# Altium project caton-pcb.PrjPcb (part 1 of 2)
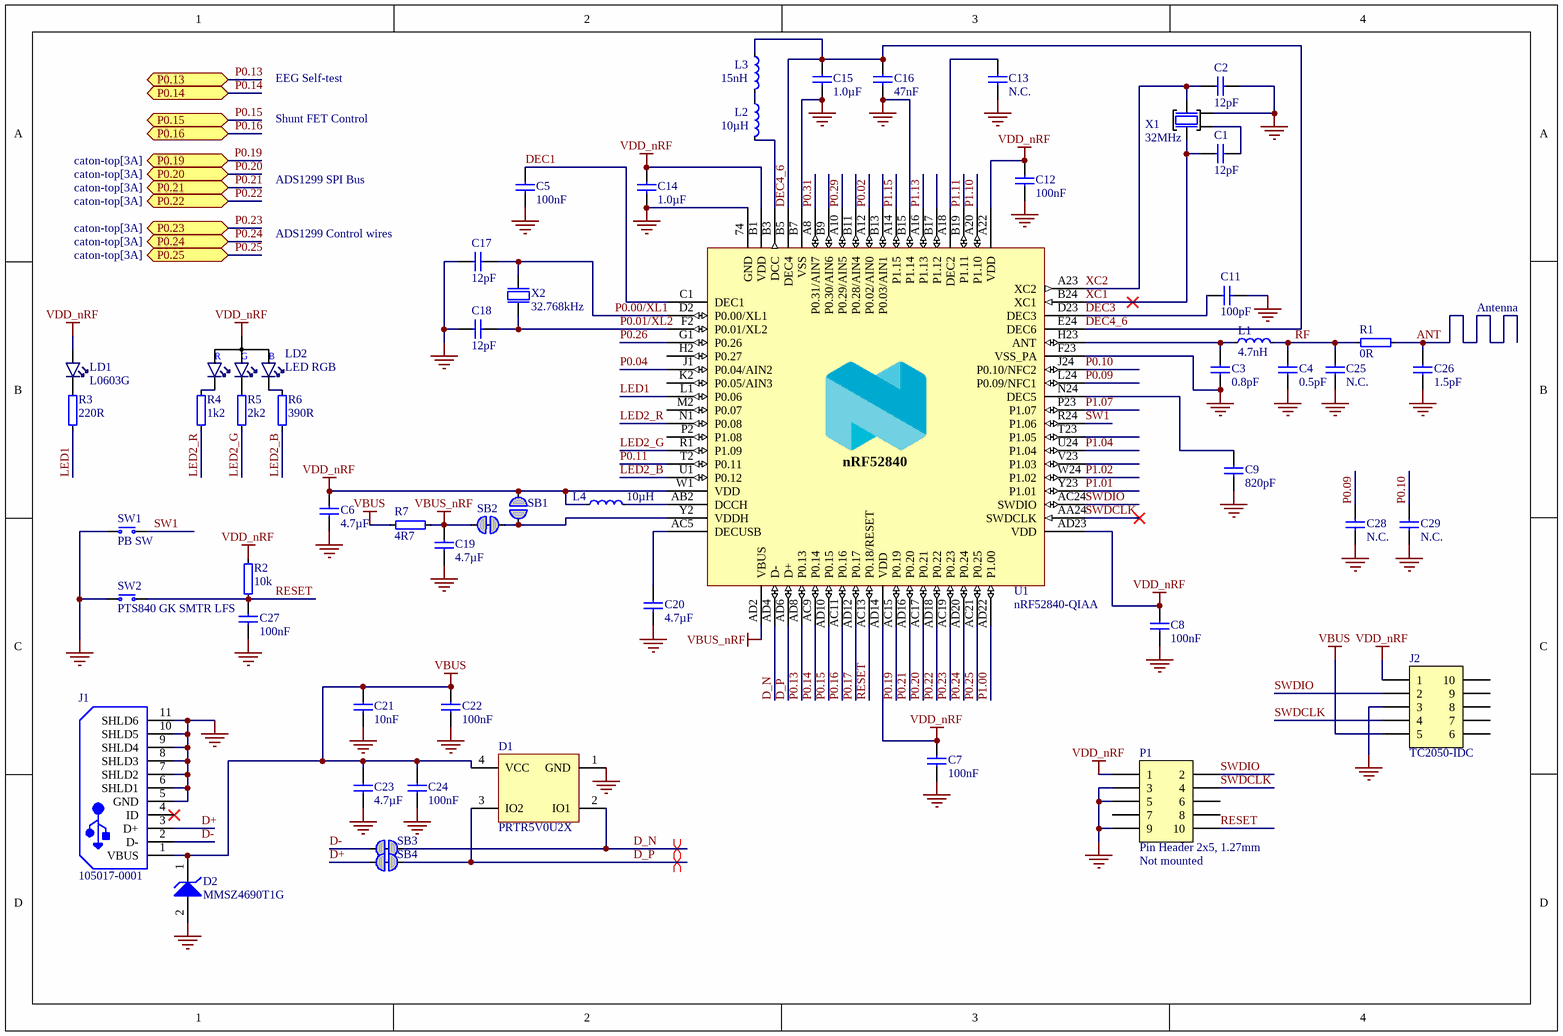
[diagram p0: caton-nrf52840.SchDoc]
3 sheets, 147 parts. Net scope: hierarchical (ports join the sheet entries above them; power ports are global).
Board files: 400250.PcbDoc, caton.PcbDoc
Sheets:
  caton-nrf52840.SchDoc
  caton-top.SchDoc
  caton-ads1299.SchDoc

## Sheet caton-nrf52840.SchDoc: =BoardTitle
size A4; Organization: Nordic Semiconductor; SheetNumber: 2; SheetTotal: 3; CompanyName: Nordic Semiconductor; DocumentSize: A4; ProjectName: caton-pcb.PrjPcb

### Parts
(Parts that share a designator on the sheet are numbered #1, #2 ... from top to bottom, then left to right.)
C1#1  12pF  [CAPC0603X03L_C]
C2#1  12pF  [CAPC0603X03L_C]
C3#1  0.8pF  [CAPC0603X03L_C]
C4#1  0.5pF  [CAPC0603X03L_C]
C5#1  100nF  [CAPC0603X03L_C]
C6#1  4.7µF  [CAPC1608X06L]
C7#1  100nF  [CAPC0603X03L_C]
C8#1  100nF  [CAPC0603X03L_C]
C9#1  820pF  [CAPC0603X03L_C]
C11#1  100pF  [CAPC0603X03L_C]
C12#1  100nF  [CAPC0603X03L_C]
C13#1  N.C.  [CAPC0603X03L_C_NC]
C14#1  1.0µF  [CAPC1608X06L]
C15#1  1.0µF  [CAPC1608X06L]
C16#1  47nF  [CAPC0603X03L_C]
C17#1  12pF  [CAPC0603X03L_C]
C18#1  12pF  [CAPC0603X03L_C]
C19#1  4.7µF  [CAPC1005X04L]
C20#1  4.7µF  [CAPC1608X06L]
C21#1  10nF  [CAPC0603X03L_C]
C22#1  100nF  [CAPC0603X03L_C]
C23#1  4.7µF  [CAPC1005X04L]
C24#1  100nF  [CAPC0603X03L_C]
C25#1  N.C.  [CAPC0603X03L_C_NC]
C26#1  1.5pF  [CAPC0603X03L_C]
C27#1  100nF  [CAPC0603X03L_C]
C28#1  N.C.  [CAPC1005X04L_NC]
C29  N.C.  [CAPC1005X04L_NC]
D1  PRTR5V0U2X  [SOT190P230X110-4L]
D2  MMSZ4690T1G  [ONSC-SOD-123-2-425-04_V]
J1#1  105017-0001  [USB-MICRO-B_V]
J2#1  TC2050-IDC  [TC2050-IDC-NLFP]  (no BOM)
L1  4.7nH  [INDC0603X03L_C]
L2  10µH  [INDC1608X06L]
L3  15nH  [INDC1005X04L]
L4  10µH  [INDC1608X06L]
LD1  L0603G  [LED_0603_G]
LD2  LED RGB  [LED_RGB_0603]
P1  Pin Header 2x5, 1.27mm  Assembly: Not mounted  [HDR_2x5-SMD-1.27mm-NC]
R1#1  0R  [RESC0603X03L_C]
R2#1  10k  [RESC0603X03L_C]
R3#1  220R  [RESC0603X03L_C]
R4#1  1k2  [RESC0603X03L_C]
R5#1  2k2  [RESC0603X03L_C]
R6#1  390R  [RESC0603X03L_C]
R7#1  4R7  [RESC0603X03L_C]
SB1#1  Solderbridge  [Solderbridge]  (value not drawn)  (no BOM)
SB2  Solderbridge  [Solderbridge_Shorted]  (value not drawn)  (net tie, no BOM)
SB3  Solderbridge  [Solderbridge_Shorted]  (value not drawn)  (net tie, no BOM)
SB4  Solderbridge  [Solderbridge_Shorted]  (value not drawn)  (net tie, no BOM)
SW1  PB SW  [C&K_PTS810]
SW2  PTS840 GK SMTR LFS  [EVQP7A_J_B_K]
U1#1  nRF52840-QIAA  [AQFN50P700X700X85_HS-74N]
X1  32MHz  [BT-XTAL_2016]
X2  32.768kHz  [XTAL_2012]

### Ports
P0.13 (bidir), P0.14 (bidir), P0.15 (bidir), P0.16 (bidir), P0.19 (bidir, see caton-top[3A]), P0.20 (bidir, see caton-top[3A]), P0.21 (bidir, see caton-top[3A]), P0.22 (bidir, see caton-top[3A]), P0.23 (bidir, see caton-top[3A]), P0.24 (bidir, see caton-top[3A]), P0.25 (bidir, see caton-top[3A])

### Nets
GND: C2#1.2 C3#1.1 C4#1.1 C5#1.2 C6#1.2 C7#1.2 C8#1.2 C9#1.2 C11#1.2 C12#1.2 C13#1.2 C14#1.2 C15#1.1 C16#1.2 C17#1.2 C18#1.2 C19#1.2 C20#1.2 C21#1.1 C22#1.1 C23#1.1 C24#1.1 C25#1.2 C26#1.1 C27#1.1 C28#1.1 C29.2 D1.1(GND) D2.2(A) J1#1.5(GND) J1#1.6(SHLD1) J1#1.7(SHLD2) J1#1.8(SHLD3) J1#1.9(SHLD4) J1#1.10(SHLD5) J1#1.11(SHLD6) J2#1.3 P1.3 P1.5 P1.9 SW1.2(COM) SW2.2(COM) U1#1.74(GND) U1#1.B7(VSS) U1#1.B15(P1.14) U1#1.F23(VSS_PA) X1.2(GND)
VBUS: C21#1.2 C22#1.2 C23#1.2 C24#1.2 D1.4(VCC) D2.1(K) J1#1.1(VBUS) J2#1.5 R7#1.2
VBUS_nRF: C19#1.1 R7#1.1 SB2.2 U1#1.AD2(VBUS)
VDD_nRF: C6#1.1 C7#1.1 C8#1.1 C12#1.1 C14#1.1 J2#1.1 L4.1 LD1.2(A) LD2.4(A) P1.1 R2#1.2 SB1#1.1 U1#1.A22(VDD) U1#1.AD14(VDD) U1#1.AD23(VDD) U1#1.B1(VDD) U1#1.W1(VDD)
ANT: C26#1.2 R1#1.2
D+: J1#1.3(D+) SB4.2
D-: J1#1.2(D-) SB3.2
D_N: D1.2(IO1) SB3.1 U1#1.AD4(D-)
D_P: D1.3(IO2) SB4.1 U1#1.AD6(D+)
DEC1: C5#1.1 U1#1.C1(DEC1)
DEC3: C11#1.1 U1#1.D23(DEC3)
DEC4_6: C15#1.2 C16#1.1 L3.1 U1#1.B5(DEC4) U1#1.E24(DEC6)
LED1: R3#1.1 U1#1.L1(P0.06)
LED2_B: R6#1.1 U1#1.U1(P0.12)
LED2_G: R5#1.1 U1#1.R1(P1.09)
LED2_R: R4#1.1 U1#1.N1(P0.08)
P0.00/XL1: C17#1.1 U1#1.D2(P0.00/XL1) X2.1(inp)
P0.01/XL2: C18#1.1 U1#1.F2(P0.01/XL2) X2.2(out)
P0.02: U1#1.A12(P0.02/AIN0)
P0.04: U1#1.J1(P0.04/AIN2)
P0.09: C28#1.2 U1#1.L24(P0.09/NFC1)
P0.10: C29.1 U1#1.J24(P0.10/NFC2)
P0.11: U1#1.T2(P0.11)
P0.13: U1#1.AD8(P0.13) ; port P0.13
P0.14: U1#1.AC9(P0.14) ; port P0.14
P0.15: U1#1.AD10(P0.15) ; port P0.15
P0.16: U1#1.AC11(P0.16) ; port P0.16
P0.17: U1#1.AD12(P0.17)
P0.19: U1#1.AC15(P0.19) ; port P0.19
P0.20: U1#1.AC17(P0.21) ; port P0.20
P0.21: U1#1.AD16(P0.20) ; port P0.21
P0.22: U1#1.AD18(P0.22) ; port P0.22
P0.23: U1#1.AC19(P0.23) ; port P0.23
P0.24: U1#1.AD20(P0.24) ; port P0.24
P0.25: U1#1.AC21(P0.25) ; port P0.25
P0.26: U1#1.G1(P0.26)
P0.29: U1#1.A10(P0.29/AIN5)
P0.31: U1#1.A8(P0.31/AIN7)
P1.00: U1#1.AD22(P1.00)
P1.01: U1#1.Y23(P1.01)
P1.02: U1#1.W24(P1.02)
P1.04: U1#1.U24(P1.04)
P1.07: U1#1.P23(P1.07)
P1.10: U1#1.A20(P1.10)
P1.11: U1#1.B19(P1.11)
P1.13: U1#1.A16(P1.13)
P1.15: U1#1.A14(P1.15)
RESET: C27#1.2 P1.10 R2#1.1 SW2.1(N.O) U1#1.AC13(P0.18/RESET)
RF: C4#1.2 C25#1.1 L1.2 R1#1.1
SW1: SW1.1(N.O) U1#1.R24(P1.06)
SWDCLK: J2#1.4 P1.4 U1#1.AA24(SWDCLK)
SWDIO: J2#1.2 P1.2 U1#1.AC24(SWDIO)
XC1: C1#1.1 U1#1.B24(XC1) X1.1(IN)
XC2: C2#1.1 U1#1.A23(XC2) X1.3(OUT)
NetC1#1_2: C1#1.2 X1.4(GND)
NetC3#1_2: C3#1.2 L1.1 U1#1.H23(ANT)
NetC9#1_1: C9#1.1 U1#1.N24(DEC5)
NetC13#1_1: C13#1.1 U1#1.A18(DEC2)
NetC20#1_1: C20#1.1 U1#1.AC5(DECUSB)
NetL2_1: L2.1 L3.2
NetL2_2: L2.2 U1#1.B3(DCC)
NetL4_2: L4.2 U1#1.AB2(DCCH)
NetLD1_1: LD1.1(C) R3#1.2
NetLD2_1: LD2.1(C_RED) R4#1.2
NetLD2_2: LD2.2(C_GREEN) R5#1.2
NetLD2_3: LD2.3(C_BLUE) R6#1.2
NetSB1#1_2: SB1#1.2 SB2.1 U1#1.Y2(VDDH)

Not connected (* = marked no-connect by the designer): J1#1 4(ID)*; J2#1 6 7 8 9 10; P1 6 7 8; U1#1 B9(P0.30/AIN6) B11(P0.28/AIN4) B13(P0.03/AIN1) B17(P1.12) H2(P0.27) K2(P0.05/AIN3) M2(P0.07) P2(P1.08) T23(P1.05) V23(P1.03)

### Layout directives
differential pair: D_N, D_P

### Notes on the sheet
- EEG Self-test
- Shunt FET Control
- ADS1299 SPI Bus
- ADS1299 Control wires
- Antenna
- Title
- Size
- Date:
- A4
- PCB Assembly Number
- Sheet         of
- Revision
- File:
- Drawn By:
- (in symbol APHF1608LSEEQBDZGKC) R; G; B
- (in symbol nRF52840-QIAAF0) nRF52840

### Library data of the parts
C1#1 C2#1 C17#1 C18#1 = C0201-12p: Capacitor, NP0, ±2%; Manufacturer: N.A.; Part number IPS: 00000007848; Note: 25V; Pad Count: 2; Part Number: C0201-12p; Manufacturer Part Number: N.A.; LatestRevisionDate: 2017-11-09; Published: 2014-11-13; Value: 12pF; Artikkelnr Noca: N.A.; Footprint Doc: 0201; ComponentLink1Description: Datasheet; ComponentLink1URL: N.A.; ComponentLink2Description: Supplier link; ComponentLink2URL: N.A.; HelpURL: N.A.; Supplier 1: N.A.; Supplier Part Number 1: N.A.; Supplier 2: N.A.; Supplier Part Number 2: N.A.; PartId: 100200033; Component Class: Capacitors; Author: rsk; Part number Norautron: N.A.
C3#1 = C0201-0.8p: Capacitor, NP0, ±0.05pF, 50V; Manufacturer: Murata; Manufacturer Part Number: GJM0335C1HR80WB01; Part number IPS: 80000001975; Artikkelnr Noca: N.A.; Pad Count: 2; Part Number: C0201-0.8p; LatestRevisionDate: 2018-10-22; Published: 2014-11-13; Value: 0.8pF; Note: 50V; Footprint Doc: 0201; ComponentLink1Description: Datasheet; ComponentLink1URL: N.A.; ComponentLink2Description: Supplier link; ComponentLink2URL: N.A.; HelpURL: N.A.; Supplier 1: N.A.; Supplier Part Number 1: N.A.; Supplier 2: N.A.; Supplier Part Number 2: N.A.; PartId: 100200012; Component Class: Capacitors; Author: rsk; Part number Norautron: N.A.
C4#1 = C0201-0.5p: Capacitor, NP0, ±0.05pF; Manufacturer: N.A.; Note: 50V; Pad Count: 2; Part Number: C0201-0.5p; Manufacturer Part Number: N.A.; LatestRevisionDate: 2018-10-22; Published: 2014-11-13; Value: 0.5pF; Artikkelnr Noca: N.A.; Footprint Doc: 0201; Part number IPS: N.A.; ComponentLink1Description: Datasheet; ComponentLink1URL: N.A.; ComponentLink2Description: Supplier link; ComponentLink2URL: N.A.; HelpURL: N.A.; Supplier 1: N.A.; Supplier Part Number 1: N.A.; Supplier 2: N.A.; Supplier Part Number 2: N.A.; PartId: 100200008; Component Class: Capacitors; Author: rsk; Part number Norautron: N.A.
C5#1 C7#1 C8#1 C12#1 C22#1 C24#1 C27#1 = C0201-100n: Capacitor, X5R, ±10%; Manufacturer: N.A.; Part number IPS: 00000001248, 00000002505; Note: 16V; Pad Count: 2; Part Number: C0201-100n; Manufacturer Part Number: N.A.; LatestRevisionDate: 2017-11-09; Published: 2014-11-13; Value: 100nF; Artikkelnr Noca: N.A.; Footprint Doc: 0201; ComponentLink1Description: Datasheet; ComponentLink1URL: N.A.; ComponentLink2Description: Supplier link; ComponentLink2URL: N.A.; HelpURL: N.A.; Supplier 1: N.A.; Supplier Part Number 1: N.A.; Supplier 2: N.A.; Supplier Part Number 2: N.A.; PartId: 100200078; Component Class: Capacitors; Author: rsk; Part number Norautron: N.A.
C6#1 C20#1 = C0603-4µ7: Capacitor, X5R, ±10%; Manufacturer: N.A.; Part number IPS: 00000007783; Note: 6.3V; Artikkelnr Noca: 20069060; Pad Count: 2; Part Number: C0603-4µ7; Manufacturer Part Number: N.A.; LatestRevisionDate: 2009-11-23; Published: 2009-05-08; Value: 4.7µF; Footprint Doc: 0603; ComponentLink1Description: Datasheet; ComponentLink1URL: N.A.; ComponentLink2Description: Supplier link; ComponentLink2URL: N.A.; HelpURL: N.A.; Supplier 1: N.A.; Supplier Part Number 1: N.A.; Supplier 2: N.A.; Supplier Part Number 2: N.A.; PartId: 100200274; Component Class: Capacitors; Author: rsk; Part number Norautron: N.A.
C9#1 = C0201-820p: Capacitor, X7R, ±10%; Manufacturer: N.A.; Part number IPS: 00000001249; Note: 25V; Pad Count: 2; Part Number: C0201-820p; Manufacturer Part Number: N.A.; LatestRevisionDate: 2017-11-09; Published: 2014-11-13; Value: 820pF; Artikkelnr Noca: N.A.; Footprint Doc: 0201; ComponentLink1Description: Datasheet; ComponentLink1URL: N.A.; ComponentLink2Description: Supplier link; ComponentLink2URL: N.A.; HelpURL: N.A.; Supplier 1: N.A.; Supplier Part Number 1: N.A.; Supplier 2: N.A.; Supplier Part Number 2: N.A.; PartId: 100200055; Component Class: Capacitors; Author: rsk; Part number Norautron: N.A.
C11#1 = C0201-100p: Capacitor, NP0, ±2%, 25V; Manufacturer: Murata; Manufacturer Part Number: GRM0335C1E101GA01; Part number IPS: 00000007853; Artikkelnr Noca: N.A.; Pad Count: 2; Part Number: C0201-100p; LatestRevisionDate: 2019-04-16; Published: 2019-04-16; Value: 100pF; Note: 25V; Footprint Doc: 0201; ComponentLink1Description: Datasheet; ComponentLink1URL: N.A.; ComponentLink2Description: Supplier link; ComponentLink2URL: N.A.; HelpURL: N.A.; Supplier 1: N.A.; Supplier Part Number 1: N.A.; Supplier 2: N.A.; Supplier Part Number 2: N.A.; PartId: 100200044; Component Class: Capacitors; Author: rsk; Part number Norautron: N.A.
C13#1 C25#1 = C0201-N.C.: Not mounted; Manufacturer: N.A.; Note: Chip Cap; Assembly: Not mounted; Pad Count: 2; Part Number: C0201-N.C.; Manufacturer Part Number: N.A.; LatestRevisionDate: 2014-11-13; Published: 2014-11-13; Value: N.C.; Artikkelnr Noca: N.A.; Footprint Doc: 0201; Part number IPS: N.A.; ComponentLink1Description: Datasheet; ComponentLink1URL: N.A.; ComponentLink2Description: Supplier link; ComponentLink2URL: N.A.; HelpURL: N.A.; Supplier 1: N.A.; Supplier Part Number 1: N.A.; Supplier 2: N.A.; Supplier Part Number 2: N.A.; PartId: 100200001; Component Class: Capacitors; Author: rsk; Part number Norautron: N.A.
C14#1 C15#1 = C0603-1µ0: Capacitor, X7R, ±10%; Manufacturer: N.A.; Part number IPS: 00000000616; Note: 16V; Artikkelnr Noca: 20039282; Pad Count: 2; Part Number: C0603-1µ0; Manufacturer Part Number: N.A.; LatestRevisionDate: 2013-06-05; Published: 2009-05-08; Value: 1.0µF; Footprint Doc: 0603; ComponentLink1Description: Datasheet; ComponentLink1URL: N.A.; ComponentLink2Description: Supplier link; ComponentLink2URL: N.A.; HelpURL: N.A.; Supplier 1: N.A.; Supplier Part Number 1: N.A.; Supplier 2: N.A.; Supplier Part Number 2: N.A.; PartId: 100200271; Component Class: Capacitors; Author: rsk; Part number Norautron: N.A.
C16#1 = C0201-47n: Capacitor, X5R, ±10%; Manufacturer: N.A.; Part number IPS: 00000001250; Note: 10V; Pad Count: 2; Part Number: C0201-47n; LatestRevisionDate: 2017-11-09; Published: 2014-11-13; Value: 47nF; Footprint Doc: 0201; Manufacturer Part Number: N.A.; Artikkelnr Noca: N.A.; ComponentLink1Description: Datasheet; ComponentLink1URL: N.A.; ComponentLink2Description: Supplier link; ComponentLink2URL: N.A.; HelpURL: N.A.; Supplier 1: N.A.; Supplier Part Number 1: N.A.; Supplier 2: N.A.; Supplier Part Number 2: N.A.; PartId: 100200074; Component Class: Capacitors; Author: rsk; Part number Norautron: N.A.
C19#1 C23#1 = C0402-4µ7: Capacitor, X5R, ±20%; Manufacturer: N.A.; Part number IPS: 00000001251, 00000007165; Note: 10V; Artikkelnr Noca: 20039482; Pad Count: 2; Part Number: C0402-4µ7; Manufacturer Part Number: N.A.; LatestRevisionDate: 2017-11-09; Published: 2009-05-08; Value: 4.7µF; Footprint Doc: 0402; ComponentLink1Description: Datasheet; ComponentLink1URL: N.A.; ComponentLink2Description: Supplier link; ComponentLink2URL: N.A.; HelpURL: N.A.; Supplier 1: Digi-Key; Supplier Part Number 1: 490-13252-1-ND; Supplier 2: N.A.; Supplier Part Number 2: N.A.; PartId: 100200193; Component Class: Capacitors; Author: rsk; Part number Norautron: N.A.
C21#1 = C0201-10n: Capacitor, X7R, ±10%; Manufacturer: N.A.; Part number IPS: 00000003480; Note: 10V; Pad Count: 2; Part Number: C0201-10n; Manufacturer Part Number: N.A.; LatestRevisionDate: 2017-11-09; Published: 2014-11-13; Value: 10nF; Artikkelnr Noca: N.A.; Footprint Doc: 0201; ComponentLink1Description: Datasheet; ComponentLink1URL: N.A.; ComponentLink2Description: Supplier link; ComponentLink2URL: N.A.; HelpURL: N.A.; Supplier 1: N.A.; Supplier Part Number 1: N.A.; Supplier 2: N.A.; Supplier Part Number 2: N.A.; PartId: 100200067; Component Class: Capacitors; Author: rsk; Part number Norautron: N.A.
C26#1 = C0201-1.5p: Capacitor, NP0, ±0.1pF; Manufacturer: N.A.; Part number IPS: 00000007107; Note: 50V; Pad Count: 2; Part Number: C0201-1.5p; Manufacturer Part Number: N.A.; LatestRevisionDate: 2017-11-09; Published: 2014-11-13; Value: 1.5pF; Artikkelnr Noca: N.A.; Footprint Doc: 0201; ComponentLink1Description: Datasheet; ComponentLink1URL: N.A.; ComponentLink2Description: Supplier link; ComponentLink2URL: N.A.; HelpURL: N.A.; Supplier 1: N.A.; Supplier Part Number 1: N.A.; Supplier 2: N.A.; Supplier Part Number 2: N.A.; PartId: 100200017; Component Class: Capacitors; Author: rsk; Part number Norautron: N.A.
C28#1 C29 = C0402-N.C.: Not mounted; Manufacturer: N.A.; Assembly: Not mounted; Note: Chip Cap; Pad Count: 2; Part Number: C0402-N.C.; Manufacturer Part Number: N.A.; Footprint Doc: 0402; LatestRevisionDate: 2009-05-08; Published: 2009-05-08; Value: N.C.; Artikkelnr Noca: N.A.; Part number IPS: N.A.; ComponentLink1Description: Datasheet; ComponentLink1URL: N.A.; ComponentLink2Description: Supplier link; ComponentLink2URL: N.A.; HelpURL: N.A.; Supplier 1: N.A.; Supplier Part Number 1: N.A.; Supplier 2: N.A.; Supplier Part Number 2: N.A.; PartId: 100200105; Component Class: Capacitors; Author: rsk; Part number Norautron: N.A.
D1 = PRTR5V0U2X: Ultra low capacitance double rail-to-rail ESD protection diode; Manufacturer: NXP Semiconductors; Part number IPS: 00000009951; Note: N.A.; Artikkelnr Noca: 10069015; Pad Count: 4; Part Number: PRTR5V0U2X; Manufacturer Part Number: PRTR5V0U2X; LatestRevisionDate: 2017-11-09; Published: 2012-06-11; Value: PRTR5V0U2X; Footprint Doc: SOT-143B; ComponentLink1Description: Datasheet; ComponentLink1URL: N.A.; ComponentLink2Description: Supplier link; ComponentLink2URL: N.A.; HelpURL: http://www.farnell.com/datasheets/109718.pdf; Supplier 1: Digi-Key; Supplier Part Number 1: 568-4140-1-ND; Supplier 2: Farnell; Supplier Part Number 2: 152-4157; PartId: 101300082; Component Class: Semiconductors; Author: rsk; Part number Norautron: N.A.
D2 = CMP-1060-00407-1: Zener Voltage Regulator, 500 mW, 2-Pin SOD-123, Pb-Free, Tape and Reel; Manufacturer: On Semiconductor; VZ Typ (V): 5.6; P Max (W): 0.5; Packing: Tape and Reel; ComponentLink1URL: http://www.onsemi.com/; ComponentLink2URL: http://www.onsemi.com/pub_link/Collateral/MMSZ4678T1-D.PDF; PartNumber: MMSZ4690T1G; ComponentLink1Description: Manufacturer URL; ComponentLink3URL: http://www.onsemi.com/pub_link/Collateral/425-04.PDF; RoHS: Pb-Free; Mounting Technology: Surface Mount; PackageDescription: 2-Pin SOD, Body 1.6 x 2.69 mm; PackageVersion: Rev. G, 10/2009; ComponentLink2Description: Datasheet; ComponentLink3Description: Package Specification; DatasheetVersion: Rev. 9; PackageReference: SOD-123-2-425-04
J1#1 = CMP-2000-05827-1: Micro-USB B Receptacle, Right Angle, Bottom Mount, Surface Mount, with Solder Tabs, -30 to 85 degC, 5-Pin USB, RoHS, Tape and Reel; Manufacturer: Molex; Featured Product: Micro-USBConnectorsUSBConnectors; Other Names: WM1399DKR; Package Version: Rev. F, 12/2012; Number of Contacts: 5; Connector Type: USB-microB; Catalog Drawings: 1050170001; 3D Model: 105017-0001.stp; Mating Products: WM17145-ND-CABLEMICROUSBBTOSTDA1.0MWM17147-ND-CABLEMICROUSBBTOSTDA2.0MWM17146-ND-CABLEMICROUSBBTOSTDA1.5M; PCN Assembly/Origin: ResinSupplier21/Oct/2015; Voltage - Max: 30V; Online Catalog: Molex-MicroUSB; Manufacturer URL: http://www.molex.com/; Package Description: 5-Leads USB, Micro B, Body 7.5 x 5 mm, Pitch 0.65 mm; Datasheet URL: http://www.molex.com/elqNow/elqRedir.htm?ref=http://www.molex.com/webdocs/datasheets/pdf/en-us/1050170001_IO_CONNECTORS.pdf; Ingress Protection: -; Datasheet Version: 03/2016; Mounting Type: BoardCutout,SurfaceMount,RightAngle; Circuits: 5; Standard Package: 1; Package Reference: MICRO-B; Package URL: http://www.molex.com/pdm_docs/sd/1050170001_sd.pdf; Category: Connectors,Interconnects; Series: -; RoHS Information: 1050170001CertofCompliance; Features: Shielded,SolderRetention; Family: USB,DVI,HDMIConnectors; Specifications: -; Gender: Receptacle; Packaging: Digi-Reel®; Mounting Technology: SurfaceMount
J2#1 = TC2050-IDC-NLFP: CBL PLUG-OF-NAILS 10-PIN; Manufacturer: Tag-Connect LLC; Artikkelnr Noca: N.A.; Pad Count: 10; Part Number: TC2050-IDC-NLFP; Manufacturer Part Number: TC2050-IDC-NLFP; LatestRevisionDate: 2012-11-21; Published: 2012-11-21; Value: TC2050-IDC; Footprint Doc: TC2050-IDC-NLFP; ComponentLink1Description: Datasheet; ComponentLink1URL: N.A.; ComponentLink2Description: Supplier link; ComponentLink2URL: N.A.; HelpURL: http://www.tag-connect.com/Materials/TC2050-IDC%20Datasheet.pdf; Part number IPS: N.A.; Supplier 1: Digi-Key; Supplier Part Number 1: TC2050-IDC-NL-ND; Supplier 2: N.A.; Supplier Part Number 2: N.A.; PartId: 100500463; Component Class: Connectors; Author: rsk; Note: N.A.; Part number Norautron: N.A.
L1 = L0201-4n7: Inductor, 350mA, ±3%; Manufacturer: Murata; Manufacturer Part Number: LQP03TN4N7H02D; Part number IPS: 00000001792; Note: N.A.; Pad Count: 2; Part Number: L0201-4n7; LatestRevisionDate: 2013-04-10; Published: 2013-04-10; Value: 4.7nH; Artikkelnr Noca: N.A.; Footprint Doc: 0201; ComponentLink1Description: Datasheet; ComponentLink2Description: Supplier link; ComponentLink1URL: N.A.; HelpURL: N.A.; ComponentLink2URL: N.A.; Supplier 1: N.A.; Supplier Part Number 1: N.A.; Supplier 2: N.A.; Supplier Part Number 2: N.A.; PartId: 100300024; Component Class: Inductors; Author: rsk; Part number Norautron: N.A.
L2 L4 = L0603-10µ: Inductor, 80mA, ±10%; Manufacturer: Taiyo Yuden; Manufacturer Part Number: LBMF1608T100K; Part number IPS: 00000007794; Part number Norautron: N.A.; Note: LBMF1608T100K 10µH 80mA 0603; Artikkelnr Noca: 33029314; Pad Count: 2; Part Number: L0603-10µ; LatestRevisionDate: 2012-09-19; Published: 2010-02-24; Value: 10µH; Footprint Doc: 0603; ComponentLink1Description: Datasheet; ComponentLink1URL: N.A.; ComponentLink2Description: Supplier link; HelpURL: http://www.yuden.co.jp/ut/product/pdf/elb2_e.pdf; ComponentLink2URL: N.A.; Supplier 1: Digi-Key; Supplier Part Number 1: 587-1714-1-ND; Supplier 2: Farnell; Supplier Part Number 2: 178-6105; PartId: 100300078; Component Class: Inductors; Author: rsk
L3 = L0402-15n: Inductor, 320mA, ±5%; Manufacturer: Taiyo Yuden; Manufacturer Part Number: HK100515NJ-T; Part number IPS: 00000001262; Part number Norautron: N.A.; Note: High frequency chip inductor ±10%; Artikkelnr Noca: 33029323; Pad Count: 2; Part Number: L0402-15n; LatestRevisionDate: 2012-09-19; Published: 2010-07-12; Value: 15nH; Footprint Doc: 0402; ComponentLink1Description: Datasheet; ComponentLink1URL: N.A.; ComponentLink2Description: Supplier link; HelpURL: http://www.yuden.co.jp/productdata/catalog/en/mlci04_e.pdf; ComponentLink2URL: N.A.; Supplier 1: Digi-Key; Supplier Part Number 1: 587-1521-1-ND; Supplier 2: Farnell; Supplier Part Number 2: 658-1328; PartId: 100300056; Component Class: Inductors; Author: rsk
LD1 = VS 25C7M5: LED, Green, 0603, 573nm, Vf=2.0V, 24mcd, - 40 to +85°C; Manufacturer: Victory Electronics; Part number IPS: 00000001274, 00000009961; Note: N.A.; Artikkelnr Noca: 13019193; Pad Count: 2; Part Number: VS 25C7M5; Manufacturer Part Number: VS 25C7M5; LatestRevisionDate: 2020-10-23; Published: 2017-08-21; Value: L0603G; Footprint Doc: 0603; ComponentLink1Description: Datasheet; ComponentLink1URL: N.A.; ComponentLink2Description: Supplier link; ComponentLink2URL: N.A.; HelpURL: \\hizz\pro\app9717\Datasheet\optoelectronics\Victory Electronics\VS 25C7M5.pdf; Supplier 1: EC Partner; Supplier Part Number 1: N.A.; Supplier 2: N.A.; Supplier Part Number 2: N.A.; PartId: 101400097; Component Class: Optoelectronics; Author: rsk; Part number Norautron: N.A.
LD2 = APHF1608LSEEQBDZGKC: RGB LED 1.60 mm x 0.80 mm SMD; Manufacturer: Kingbright Company LLC; Part number IPS: 00000001254; Note: N.A.; Pad Count: 4; Part Number: APHF1608LSEEQBDZGKC; Manufacturer Part Number: APHF1608LSEEQBDZGKC; LatestRevisionDate: 2017-11-09; Published: 2017-09-18; Value: LED RGB; Artikkelnr Noca: N.A.; Footprint Doc: LED_RGB_0603; ComponentLink1Description: Datasheet; ComponentLink1URL: N.A.; ComponentLink2Description: Supplier link; ComponentLink2URL: N.A.; HelpURL: http://www.kingbrightusa.com/images/catalog/SPEC/APHF1608LSEEQBDZGKC.pdf; Supplier 1: Digi-Key; Supplier Part Number 1: 754-2143-1-ND; Supplier 2: N.A.; Supplier Part Number 2: N.A.; PartId: 101400123; Component Class: Optoelectronics; Author: rsk; Part number Norautron: N.A.
P1 = Pin Header 2x5 SMD, 1.27mm, KS, N.C.: Pin Header 2x5, 1.27mm (50mil), SMD, Keying Shroud; Manufacturer: W-CON; Manufacturer Part Number: 3132-10MS0BK00R1; Note: N.A.; Pad Count: 10; Part Number: Pin Header 2x5 SMD, 1.27mm, KS, N.C.; Footprint Doc: HDR_2x5-SMD-1.27mm; LatestRevisionDate: 2017-09-07; Published: 2017-09-07; Value: Pin Header 2x5, 1.27mm; Artikkelnr Noca: N.A.; Part number IPS: N.A.; ComponentLink1Description: Datasheet; ComponentLink1URL: N.A.; ComponentLink2Description: Supplier link; ComponentLink2URL: N.A.; HelpURL: \\hizz\pro\app9717\Datasheet\connectors\W-CON\3132-XXMXXBK00XX.pdf; Supplier 1: Cabcon; Supplier Part Number 1: 3132-10MS0BK00R1; Supplier 2: Samtec; Supplier Part Number 2: FTSH-105-01-F-DV-K; PartId: 100500262; Component Class: Connectors; Author: rsk; Part number Norautron: N.A.
R1#1 = R0201-0R: Resistor, ±5%, 0.05W; Manufacturer: N.A.; Part number IPS: 00000003245; Note: Chip Res 5%; Pad Count: 2; Part Number: R0201-0R; Manufacturer Part Number: N.A.; LatestRevisionDate: 2017-11-09; Published: 2014-11-13; Value: 0R; Artikkelnr Noca: N.A.; Footprint Doc: 0201; ComponentLink1Description: Datasheet; ComponentLink1URL: N.A.; ComponentLink2Description: Supplier link; ComponentLink2URL: N.A.; HelpURL: N.A.; Supplier 1: N.A.; Supplier Part Number 1: N.A.; Supplier 2: N.A.; Supplier Part Number 2: N.A.; PartId: 100100001; Component Class: Resistors; Author: rsk; Part number Norautron: N.A.
R2#1 = R0201-10k: Resistor, ±1%, 0.05W; Manufacturer: N.A.; Part number IPS: 00000001255; Note: Chip Res 1%; Pad Count: 2; Part Number: R0201-10k; Manufacturer Part Number: N.A.; LatestRevisionDate: 2014-11-13; Published: 2014-11-13; Value: 10k; Artikkelnr Noca: N.A.; Footprint Doc: 0201; ComponentLink1Description: Datasheet; ComponentLink1URL: N.A.; ComponentLink2Description: Supplier link; ComponentLink2URL: N.A.; HelpURL: N.A.; Supplier 1: N.A.; Supplier Part Number 1: N.A.; Supplier 2: N.A.; Supplier Part Number 2: N.A.; PartId: 100100065; Component Class: Resistors; Author: rsk; Part number Norautron: N.A.
R3#1 = R0201-220: Resistor, ±1%, 0.05W; Manufacturer: N.A.; Part number IPS: 00000000863; Note: Chip Res 1%; Pad Count: 2; Part Number: R0201-220; Manufacturer Part Number: N.A.; LatestRevisionDate: 2014-11-13; Published: 2014-11-13; Value: 220R; Artikkelnr Noca: N.A.; Footprint Doc: 0201; ComponentLink1Description: Datasheet; ComponentLink1URL: N.A.; ComponentLink2Description: Supplier link; ComponentLink2URL: N.A.; HelpURL: N.A.; Supplier 1: N.A.; Supplier Part Number 1: N.A.; Supplier 2: N.A.; Supplier Part Number 2: N.A.; PartId: 100100032; Component Class: Resistors; Author: rsk; Part number Norautron: N.A.
R4#1 = R0201-1k2: Resistor, ±1%, 0.05W; Manufacturer: N.A.; Part number IPS: 00000001256; Note: Chip Res 1%; Pad Count: 2; Part Number: R0201-1k2; Manufacturer Part Number: N.A.; LatestRevisionDate: 2014-11-13; Published: 2014-11-13; Value: 1k2; Artikkelnr Noca: N.A.; Footprint Doc: 0201; ComponentLink1Description: Datasheet; ComponentLink1URL: N.A.; ComponentLink2Description: Supplier link; ComponentLink2URL: N.A.; HelpURL: N.A.; Supplier 1: N.A.; Supplier Part Number 1: N.A.; Supplier 2: N.A.; Supplier Part Number 2: N.A.; PartId: 100100045; Component Class: Resistors; Author: rsk; Part number Norautron: N.A.
R5#1 = R0201-2k2: Resistor, ±1%, 0.05W; Manufacturer: N.A.; Part number IPS: 00000001257; Note: Chip Res 1%; Pad Count: 2; Part Number: R0201-2k2; Manufacturer Part Number: N.A.; LatestRevisionDate: 2014-11-13; Published: 2014-11-13; Value: 2k2; Artikkelnr Noca: N.A.; Footprint Doc: 0201; ComponentLink1Description: Datasheet; ComponentLink1URL: N.A.; ComponentLink2Description: Supplier link; ComponentLink2URL: N.A.; HelpURL: N.A.; Supplier 1: N.A.; Supplier Part Number 1: N.A.; Supplier 2: N.A.; Supplier Part Number 2: N.A.; PartId: 100100052; Component Class: Resistors; Author: rsk; Part number Norautron: N.A.
R6#1 = R0201-390: Resistor, ±1%, 0.05W; Manufacturer: N.A.; Part number IPS: 00000001258; Note: Chip Res 1%; Pad Count: 2; Part Number: R0201-390; Manufacturer Part Number: N.A.; LatestRevisionDate: 2014-11-13; Published: 2014-11-13; Value: 390R; Artikkelnr Noca: N.A.; Footprint Doc: 0201; ComponentLink1Description: Datasheet; ComponentLink1URL: N.A.; ComponentLink2Description: Supplier link; ComponentLink2URL: N.A.; HelpURL: N.A.; Supplier 1: N.A.; Supplier Part Number 1: N.A.; Supplier 2: N.A.; Supplier Part Number 2: N.A.; PartId: 100100035; Component Class: Resistors; Author: rsk; Part number Norautron: N.A.
R7#1 = R0201-4R7: Resistor, ±1%, 0.05W; Manufacturer: N.A.; Part number IPS: 00000002486; Note: Chip Res 1%; Pad Count: 2; Part Number: R0201-4R7; Manufacturer Part Number: N.A.; LatestRevisionDate: 2014-11-13; Published: 2014-11-13; Value: 4R7; Artikkelnr Noca: N.A.; Footprint Doc: 0201; ComponentLink1Description: Datasheet; ComponentLink1URL: N.A.; ComponentLink2Description: Supplier link; ComponentLink2URL: N.A.; HelpURL: N.A.; Supplier 1: N.A.; Supplier Part Number 1: N.A.; Supplier 2: N.A.; Supplier Part Number 2: N.A.; PartId: 100100010; Component Class: Resistors; Author: rsk; Part number Norautron: N.A.
SB1#1 = Solderbridge: Manufacturer: N.A.; Pad Count: 2; Part Number: Solderbridge; Manufacturer Part Number: N.A.; Footprint Doc: Solderbridge; LatestRevisionDate: 2009-12-14; Published: 2009-12-14; Value: Solderbridge; Note: N.A.; Artikkelnr Noca: N.A.; Part number IPS: N.A.; ComponentLink1Description: Datasheet; ComponentLink1URL: N.A.; ComponentLink2Description: Supplier link; ComponentLink2URL: N.A.; HelpURL: N.A.; Supplier 1: N.A.; Supplier Part Number 1: N.A.; Supplier 2: N.A.; Supplier Part Number 2: N.A.; PartId: 100500458; Component Class: Connectors; Author: rsk; Part number Norautron: N.A.
SB2-SB4 = Solderbridge Shorted: Shorted Solderbridge; Manufacturer: N.A.; Pad Count: 2; Part Number: Solderbridge Shorted; Manufacturer Part Number: N.A.; Footprint Doc: Solderbridge_Shorted; LatestRevisionDate: 2012-08-07; Published: 2012-08-07; Value: Solderbridge; Note: N.A.; Artikkelnr Noca: N.A.; Part number IPS: N.A.; ComponentLink1Description: Datasheet; ComponentLink1URL: N.A.; ComponentLink2Description: Supplier link; ComponentLink2URL: N.A.; HelpURL: N.A.; Supplier 1: N.A.; Supplier Part Number 1: N.A.; Supplier 2: N.A.; Supplier Part Number 2: N.A.; PartId: 100500459; Component Class: Connectors; Author: rsk; Part number Norautron: N.A.
SW1 = PTS810 SJK 250 SMTR LFS: Tactile Switch, SPNO, SMD, 260gf, 4.2x3.2x2.5mm; Manufacturer: C&K; Part number IPS: 00000001259; Note: N.A.; Pad Count: 4; Part Number: PTS810 SJK 250 SMTR LFS; Manufacturer Part Number: PTS810 SJK 250 SMTR LFS; LatestRevisionDate: 2017-11-09; Published: 2017-09-18; Value: PB SW; Artikkelnr Noca: N.A.; Footprint Doc: PTS810; ComponentLink1Description: Datasheet; ComponentLink1URL: N.A.; ComponentLink2Description: Supplier link; ComponentLink2URL: N.A.; HelpURL: http://www.ckswitches.com/media/1476/pts810.pdf; Supplier 1: Digi-Key; Supplier Part Number 1: CKN10503TR-ND; Supplier 2: N.A.; Supplier Part Number 2: N.A.; PartId: 101500104; Component Class: Switches; Author: rsk; Part number Norautron: N.A.
SW2 = PTS840 GK SMTR LFS: Microminiature SMT Switch, Side Actuated; Manufacturer: C&K; Part number IPS: 00000001260; Part number Norautron: N.A.; Note: Tactile Switch, SPST, SMD, 220gf; Artikkelnr Noca: 50019089; Pad Count: 4; Part Number: PTS840 GK SMTR LFS; Manufacturer Part Number: PTS840 GK SMTR LFS; LatestRevisionDate: 2017-11-09; Published: 2014-08-12; Value: PTS840 GK SMTR LFS; Footprint Doc: PTS840 Gx; ComponentLink1Description: Datasheet; ComponentLink1URL: N.A.; ComponentLink2Description: Supplier link; ComponentLink2URL: N.A.; HelpURL: http://www.ck-components.com/80185/pts840_11june13.pdf/; Supplier 1: Digi-Key; Supplier Part Number 1: CKN10508CT-ND; Supplier 2: Mouser; Supplier Part Number 2: 611-PTS840GKSMTR; PartId: 101500010; Component Class: Switches; Author: rsk
U1#1 = nRF52840-QIAAF0: Multi-protocol Bluetooth Low Energy, IEEE 802.15.4, ANT and 2.4GHz proprietary system-on-chip; Manufacturer: Nordic Semiconductor; Note: N.A.; Pad Count: 73; Part Number: nRF52840-QIAAF0; LatestRevisionDate: 2021-03-24; Published: 2021-03-24; Value: nRF52840-QIAA; Footprint Doc: AQFN-73; Manufacturer Part Number: nRF52840-QIAAF0; Artikkelnr Noca: N.A.; Part number IPS: N.A.; ComponentLink1Description: Datasheet; ComponentLink1URL: N.A.; ComponentLink2Description: Supplier link; ComponentLink2URL: N.A.; HelpURL: N.A.; Supplier 1: Nordic Semiconductor; Supplier Part Number 1: nRF52840-QIAAF0; Supplier 2: N.A.; Supplier Part Number 2: N.A.; Component Class: nRF_Devices; Author: hany; Part number Norautron: N.A.
X1 = XTAL_SMD2016_32MHz_8pF_Murata: XTAL SMD 2016, 32MHz, Cl=8pF, Tol: ±10ppm, Stab: ±10ppm; Manufacturer: Murata; Manufacturer Part Number: XRCGB32M000F1H01R0; Part number IPS: 80000001424; Note: XTAL SMD 32.000MHz; Artikkelnr Noca: N.A.; Pad Count: 4; Part Number: XTAL_SMD2016_32MHz_8pF_Murata; LatestRevisionDate: 2020-09-17; Published: 2016-10-26; Value: 32MHz; Footprint Doc: XTAL_2016; ComponentLink1Description: Datasheet; ComponentLink1URL: N.A.; ComponentLink2Description: Supplier link; ComponentLink2URL: N.A.; HelpURL: http://www.murata.com/en-global/products/productdetail.aspx?cate=cgsubCrystalUnits&partno=XRCGB32M000F1H01R0; Supplier 1: N.A.; Supplier Part Number 1: N.A.; Supplier 2: N.A.; Supplier Part Number 2: N.A.; PartId: 101600040; Component Class: Oscillators; Author: rsk; Part number Norautron: N.A.
X2 = XTAL_SMD2012_32.768kHz_9pF_Seiko: XTAL SMD 2012, 32.768kHz, 9pF, ±20ppm; Manufacturer: Seiko Instruments; Manufacturer Part Number: SC20S-9.0PF20PPM; Part number IPS: 80000001425; Note: XTAL SMD 32.768kHz; Artikkelnr Noca: N.A.; Pad Count: 2; Part Number: XTAL_SMD2012_32.768kHz_9pF_Seiko; LatestRevisionDate: 2017-11-09; Published: 2015-10-15; Value: 32.768kHz; Footprint Doc: XTAL_2012; ComponentLink1Description: Datasheet; ComponentLink1URL: N.A.; ComponentLink2Description: Supplier link; ComponentLink2URL: N.A.; HelpURL: http://www.sii.co.jp/en/quartz/files/2013/03/file_PRODUCT_MASTER_50811_GRAPHIC03.pdf; Supplier 1: N.A.; Supplier Part Number 1: N.A.; Supplier 2: N.A.; Supplier Part Number 2: N.A.; PartId: 101600015; Component Class: Oscillators; Author: rsk; Part number Norautron: N.A.

## Sheet caton-top.SchDoc: Caton-M-TRAD
size 431 x 279 mm; Date: 7/9/2024; Author: Daniel Lovell; CompanyName: University of California, Berkeley; DrawnBy: Daniel Lovell; Organization: BSAC; Revision: A; SheetNumber: 1; SheetTotal: 1
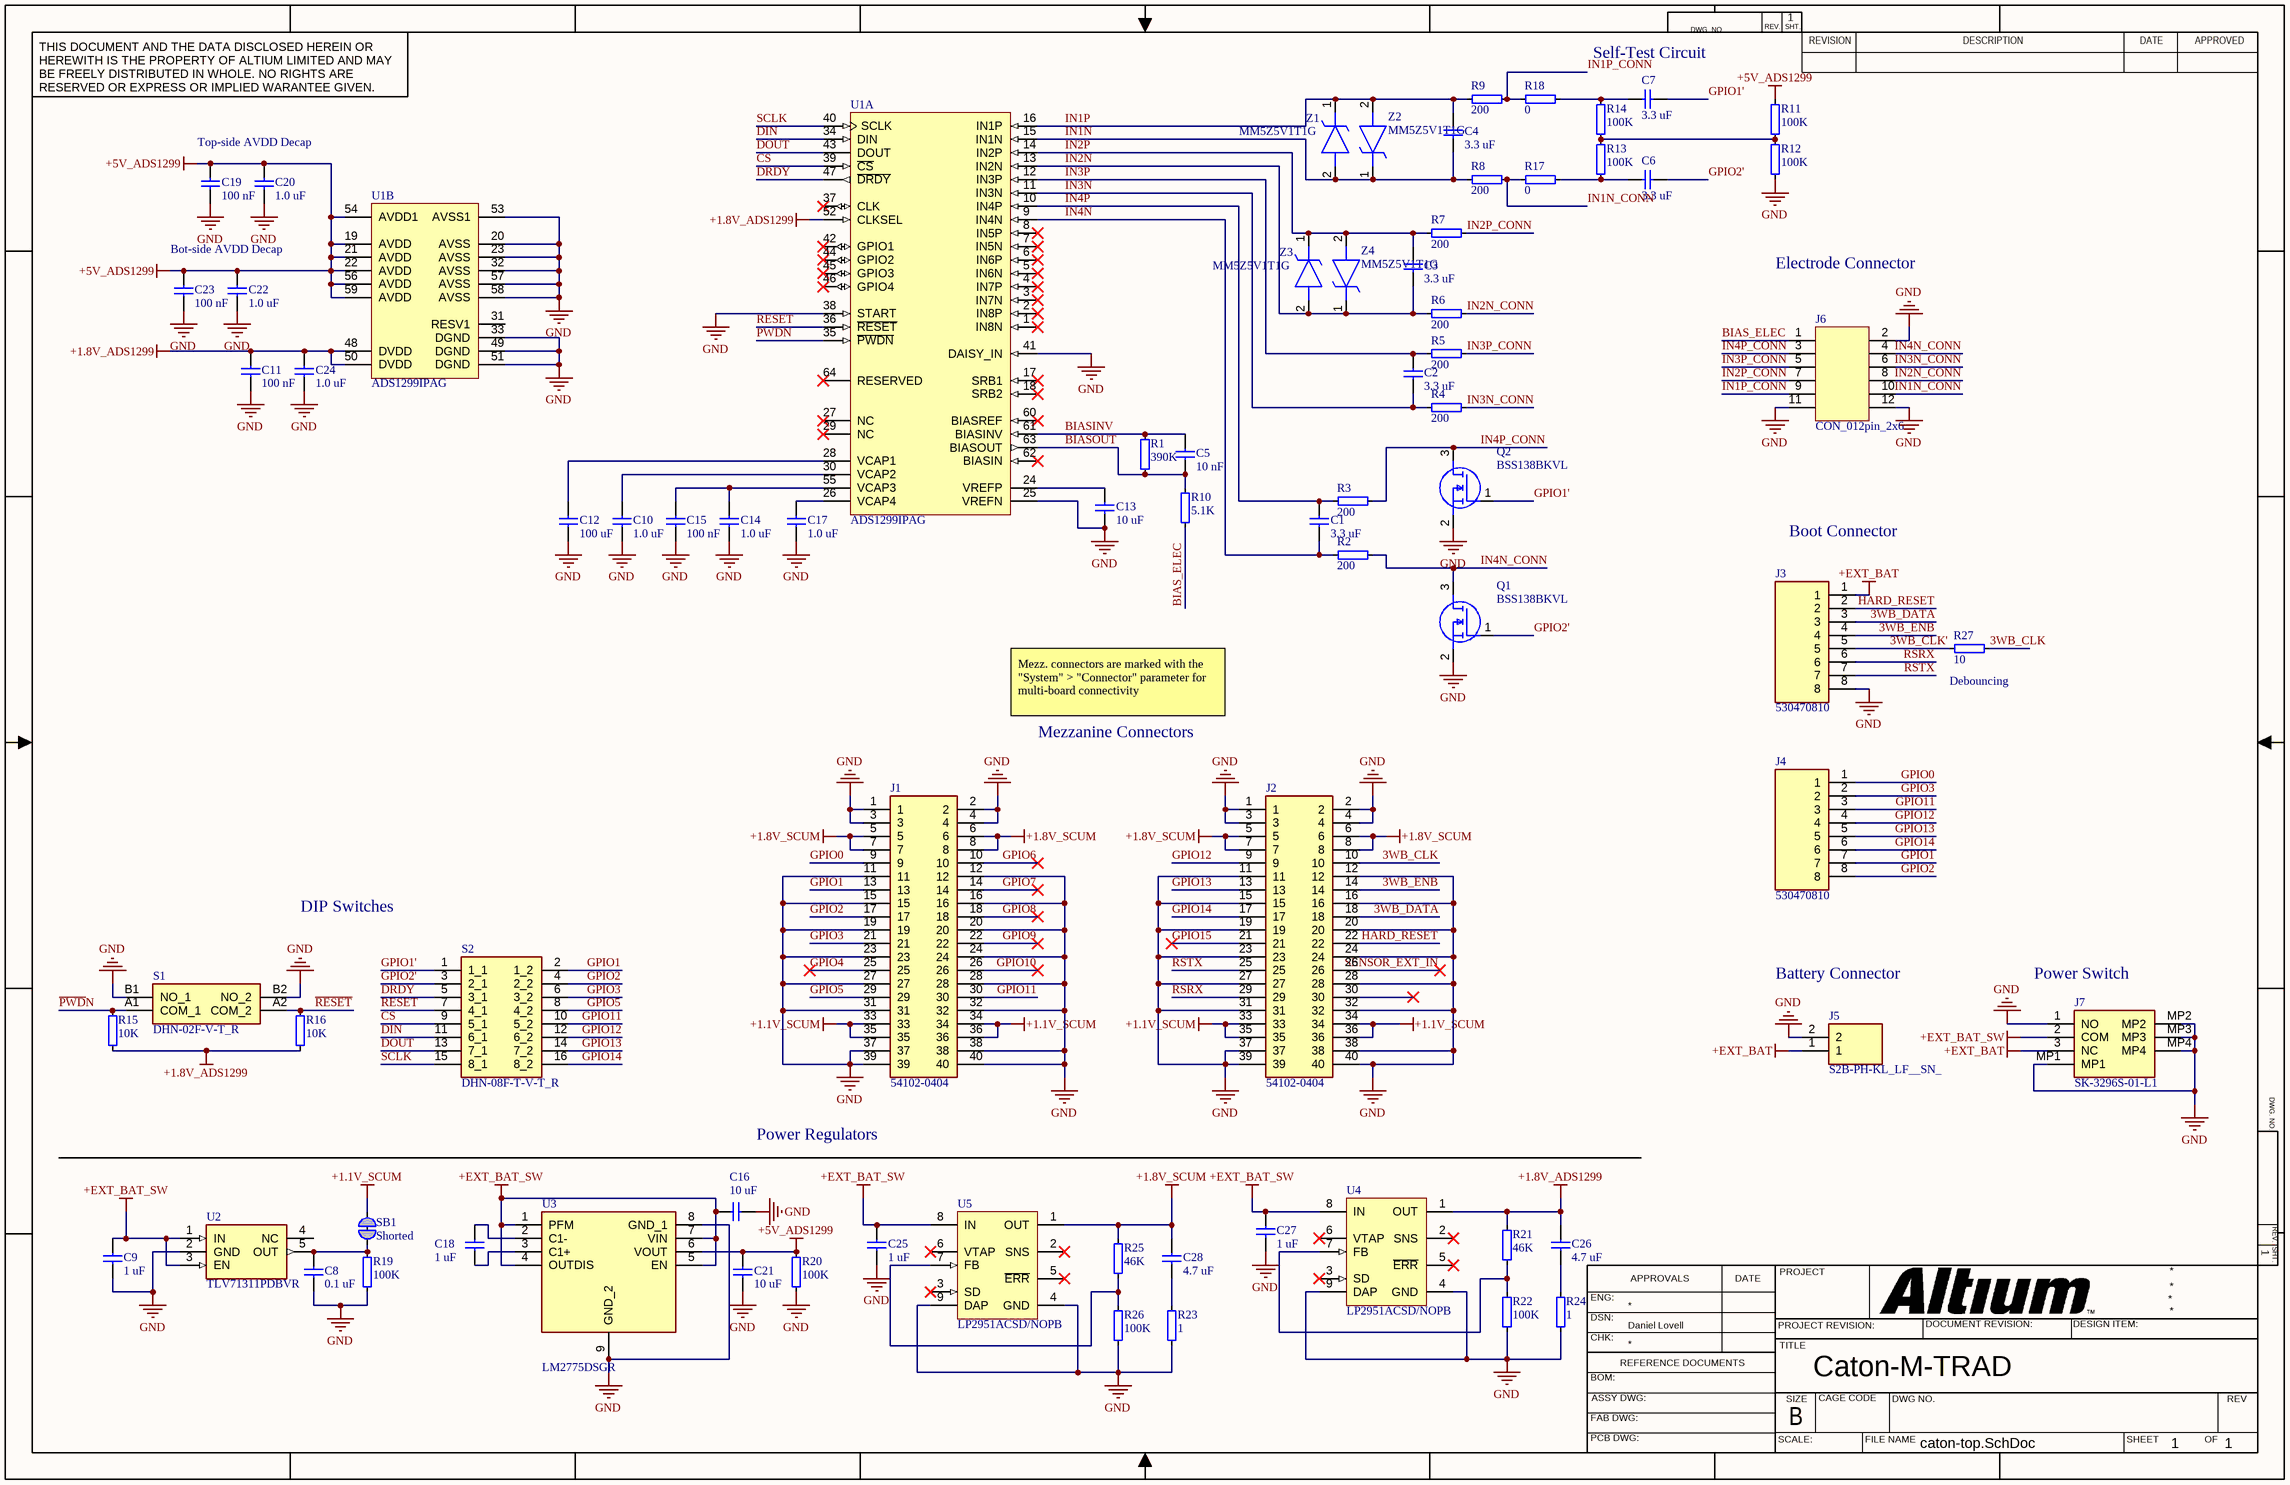
[diagram p1: caton-top.SchDoc]

### Parts
(Parts that share a designator on the sheet are numbered #1, #2 ... from top to bottom, then left to right.)
C1#2  3.3 uF  [0402]
C2#2  3.3 uF  [0402]
C3#2  3.3 uF  [0402]
C4#2  3.3 uF  [0402]
C5#2  10 nF  [0402]
C6#2  3.3 uF  [0402]
C7#2  3.3 uF  [0402]
C8#2  0.1 uF  [0402]
C9#2  1 uF  [0402]
C10  1.0 uF  [0402]
C11#2  100 nF  [0402]
C12#2  100 uF  [0805]
C13#2  10 uF  [0402]
C14#2  1.0 uF  [0402]
C15#2  100 nF  [0402]
C16#2  10 uF  [0402]
C17#2  1.0 uF  [0402]
C18#2  1 uF  [0402]
C19#2  100 nF  [0402]
C20#2  1.0 uF  [0402]
C21#2  10 uF  [0402]
C22#2  1.0 uF  [0402]
C23#2  100 nF  [0402]
C24#2  1.0 uF  [0402]
C25#2  1 uF  [0402]
C26#2  4.7 uF  [0402]
C27#2  1 uF  [0402]
C28#2  4.7 uF  [0402]
J1#2  54102-0404  [541020404]
J2#2  54102-0404  [541020404]
J3  530470810  [530470810]
J4  530470810  [530470810]
J5  S2B-PH-KL_LF__SN_  [S2BPHKLLFSN]
J6  CON_012pin_2x6  [CON-012-100-600X200/2X6-POST]
J7  SK-3296S-01-L1  [SK3296S01L1]
Q1  BSS138BKVL  [SOT95P230X110-3N]
Q2  BSS138BKVL  [SOT95P230X110-3N]
R1#2  390K  [0402]
R2#2  200  [0402]
R3#2  200  [0402]
R4#2  200  [0402]
R5#2  200  [0402]
R6#2  200  [0402]
R7#2  200  [0402]
R8  200  [0402]
R9  200  [0402]
R10  5.1K  [0402]
R11  100K  [0402]
R12  100K  [0402]
R13  100K  [0402]
R14  100K  [0402]
R15  10K  [0402]
R16  10K  [0402]
R17  0  [0603]
R18  0  [0603]
R19  100K  [0402]
R20  100K  [0402]
R21  46K  [0402]
R22  100K  [0402]
R23  1  [0402]
R24  1  [0402]
R25  46K  [0402]
R26  100K  [0402]
R27  10  [0402]
S1  DHN-02F-V-T_R  [DHN02FVTR]
S2  DHN-08F-T-V-T_R  [DHN08FTVTR]
SB1#2  Shorted  [Solderbridge_Shorted]  (net tie, no BOM)
U1#2  ADS1299IPAG  [PAG0064A_L]  (parts A,B of 2)
U2  TLV71311PDBVR  [SOT95P280X145-5N]
U3  LM2775DSGR  [SON50P200X200X80-9N]
U4  LP2951ACSD/NOPB  [NGT0008A_V]
U5  LP2951ACSD/NOPB  [NGT0008A_V]
Z1  MM5Z5V1T1G  [SODFL1608X70N]
Z2  MM5Z5V1T1G  [SODFL1608X70N]
Z3  MM5Z5V1T1G  [SODFL1608X70N]
Z4  MM5Z5V1T1G  [SODFL1608X70N]

### Nets
+1.1V_SCUM: J1#2.33 J1#2.34 J1#2.35 J1#2.36 J2#2.33 J2#2.34 J2#2.35 J2#2.36 SB1#2.2
+1.8V_ADS1299: C11#2.1 C24#2.1 C26#2.1 R15.1 R16.1 R21.2 U1#2.48(DVDD) U1#2.50(DVDD) U1#2.52(CLKSEL) U4.1(OUT)
+1.8V_SCUM: C28#2.1 J1#2.5 J1#2.6 J1#2.7 J1#2.8 J2#2.5 J2#2.6 J2#2.7 J2#2.8 R25.2 U5.1(OUT)
+5V_ADS1299: C19#2.1 C20#2.1 C21#2.1 C22#2.1 C23#2.1 R11.2 R20.2 U1#2.19(AVDD) U1#2.21(AVDD) U1#2.22(AVDD) U1#2.54(AVDD1) U1#2.56(AVDD) U1#2.59(AVDD) U3.6(VOUT)
+EXT_BAT: J3.1 J5.1 J7.3(NC)
+EXT_BAT_SW: C9#2.2 C16#2.1 C25#2.1 C27#2.1 J7.2(COM) U2.1(IN) U2.3(EN) U3.1(PFM) U3.4(OUTDIS) U3.5(EN) U3.7(VIN) U4.8(IN) U5.8(IN)
GND: C8#2.1 C9#2.1 C10.2 C11#2.2 C12#2.2 C13#2.2 C14#2.2 C15#2.2 C16#2.2 C17#2.2 C19#2.2 C20#2.2 C21#2.2 C22#2.2 C23#2.2 C24#2.2 C25#2.2 C27#2.2 J1#2.1 J1#2.2 J1#2.3 J1#2.4 J1#2.11 J1#2.12 J1#2.15 J1#2.16 J1#2.19 J1#2.20 J1#2.23 J1#2.24 J1#2.27 J1#2.28 J1#2.31 J1#2.32 J1#2.37 J1#2.38 J1#2.39 J1#2.40 J2#2.1 J2#2.2 J2#2.3 J2#2.4 J2#2.11 J2#2.12 J2#2.15 J2#2.16 J2#2.19 J2#2.20 J2#2.23 J2#2.24 J2#2.27 J2#2.28 J2#2.31 J2#2.32 J2#2.37 J2#2.38 J2#2.39 J2#2.40 J3.8 J5.2 J6.2 J6.11 J6.12 J7.1(NO) J7.MP1 J7.MP2 J7.MP3 J7.MP4 Q1.2(S) Q2.2(S) R12.1 R19.1 R20.1 R22.1 R23.1 R24.1 R26.1 S1.B1(NO_1) S1.B2(NO_2) U1#2.20(AVSS) U1#2.23(AVSS) U1#2.25(VREFN) U1#2.32(AVSS) U1#2.33(DGND) U1#2.38(START) U1#2.41(DAISY_IN) U1#2.49(DGND) U1#2.51(DGND) U1#2.53(AVSS1) U1#2.57(AVSS) U1#2.58(AVSS) U2.2(GND) U3.8(GND_1) U3.9(GND_2) U4.4(GND) U4.9(DAP) U5.4(GND) U5.9(DAP)
3WB_CLK: J2#2.10 R27.1
3WB_CLK': J3.5 R27.2
3WB_DATA: J2#2.18 J3.3
3WB_ENB: J2#2.14 J3.4
~{CS}: S2.9(5_1) U1#2.39(~{CS})
~{DRDY}: S2.5(3_1) U1#2.47(~{DRDY})
~{PWD}N: R15.2 S1.A1(COM_1) U1#2.35(~{PWDN})
~{RESET}: R16.2 S1.A2(COM_2) S2.7(4_1) U1#2.36(~{RESET})
BIAS_ELEC: J6.1 R10.1
BIASINV: C5#2.1 R1#2.2 U1#2.61(BIASINV)
BIASOUT: C5#2.2 R1#2.1 R10.2 U1#2.63(BIASOUT)
DIN: S2.11(6_1) U1#2.34(DIN)
DOUT: S2.13(7_1) U1#2.43(DOUT)
GPIO0: J1#2.9 J4.1
GPIO1: J1#2.13 J4.7 S2.2(1_2)
GPIO1': C7#2.1 Q2.1(G) S2.1(1_1)
GPIO2: J1#2.17 J4.8 S2.4(2_2)
GPIO2': C6#2.1 Q1.1(G) S2.3(2_1)
GPIO3: J1#2.21 J4.2 S2.6(3_2)
GPIO4: J1#2.25
GPIO5: J1#2.29 S2.8(4_2)
GPIO6: J1#2.10
GPIO7: J1#2.14
GPIO8: J1#2.18
GPIO9: J1#2.22
GPIO10: J1#2.26
GPIO11: J1#2.30 J4.3 S2.10(5_2)
GPIO12: J2#2.9 J4.4 S2.12(6_2)
GPIO13: J2#2.13 J4.5 S2.14(7_2)
GPIO14: J2#2.17 J4.6 S2.16(8_2)
GPIO15: J2#2.21
HARD_RESET: J2#2.22 J3.2
IN1N: C4#2.1 R8.2 U1#2.15(IN1N) Z1.2(A) Z2.1(K)
IN1N_CONN: J6.10 R8.1 R17.2
IN1P: C4#2.2 R9.2 U1#2.16(IN1P) Z1.1(K) Z2.2(A)
IN1P_CONN: J6.9 R9.1 R18.2
IN2N: C3#2.1 R6#2.2 U1#2.13(IN2N) Z3.2(A) Z4.1(K)
IN2N_CONN: J6.8 R6#2.1
IN2P: C3#2.2 R7#2.2 U1#2.14(IN2P) Z3.1(K) Z4.2(A)
IN2P_CONN: J6.7 R7#2.1
IN3N: C2#2.1 R4#2.2 U1#2.11(IN3N)
IN3N_CONN: J6.6 R4#2.1
IN3P: C2#2.2 R5#2.2 U1#2.12(IN3P)
IN3P_CONN: J6.5 R5#2.1
IN4N: C1#2.1 R2#2.2 U1#2.9(IN4N)
IN4N_CONN: J6.4 Q1.3(D) R2#2.1
IN4P: C1#2.2 R3#2.2 U1#2.10(IN4P)
IN4P_CONN: J6.3 Q2.3(D) R3#2.1
RSRX: J2#2.29 J3.6
RSTX: J2#2.25 J3.7
SCLK: S2.15(8_1) U1#2.40(SCLK)
SENSOR_EXT_IN: J2#2.26
NetC6#2_2: C6#2.2 R13.1 R17.1
NetC7#2_2: C7#2.2 R14.2 R18.1
NetC8#2_2: C8#2.2 R19.2 SB1#2.1 U2.5(OUT)
NetC10_1: C10.1 U1#2.30(VCAP2)
NetC12#2_1: C12#2.1 U1#2.28(VCAP1)
NetC13#2_1: C13#2.1 U1#2.24(VREFP)
NetC14#2_1: C14#2.1 C15#2.1 U1#2.55(VCAP3)
NetC17#2_1: C17#2.1 U1#2.26(VCAP4)
NetC18#2_1: C18#2.1 U3.3(C1+)
NetC18#2_2: C18#2.2 U3.2(C1-)
NetC26#2_2: C26#2.2 R24.2
NetC28#2_2: C28#2.2 R23.2
NetR11_1: R11.1 R12.2 R13.2 R14.1
NetR21_1: R21.1 R22.2 U4.7(FB)
NetR25_1: R25.1 R26.2 U5.7(FB)

Not connected (* = marked no-connect by the designer): J2#2 30*; U1#2 1(IN8N)* 2(IN8P)* 3(IN7N)* 4(IN7P)* 5(IN6N)* 6(IN6P)* 7(IN5N)* 8(IN5P)* 17(SRB1)* 18(SRB2)* 27(NC)* 29(NC)* 31(RESV1) 37(CLK)* 42(GPIO1)* 44(GPIO2)* 45(GPIO3)* 46(GPIO4)* 60(BIASREF)* 62(BIASIN)* 64(RESERVED)*; U2 4(NC); U4 2(SNS)* 3(SD)* 5(~{ERR})* 6(VTAP)*; U5 2(SNS)* 3(SD)* 5(~{ERR})* 6(VTAP)*

### Notes on the sheet
- Self-Test Circuit
- Top-side AVDD Decap
- Bot-side AVDD Decap
- Electrode Connector
- Boot Connector
- (near R27) Debouncing
- Mezz. connectors are marked with the "System" > "Connector" parameter for multi-board connectivity
- Mezzanine Connectors
- DIP Switches
- Battery Connector
- (near J7) Power Switch
- Power Regulators
- DWG. NO.
- REV.
- SHT.
- THIS DOCUMENT AND THE DATA DISCLOSED HEREIN OR HEREWITH IS THE PROPERTY OF ALTIUM LIMITED AND MAY BE FREELY DISTRIBUTED IN WHOLE. NO RIGHTS ARE RESERVED OR EXPRESS OR IMPLIED WARANTEE GIVEN.
- REVISION
- DESCRIPTION
- DATE
- APPROVED
- ENG:
- APPROVALS
- PROJECT
- DSN:
- CHK:
- REFERENCE DOCUMENTS
- PROJECT REVISION:
- TITLE
- DOCUMENT REVISION:
- DESIGN ITEM:
- BOM:
- FAB DWG:
- PCB DWG:
- ASSY DWG:
- SCALE:
- SIZE
- B
- CAGE CODE
- FILE NAME
- DWG NO.
- SHEET
- OF
- REV

### Library data of the parts
C1#2 C2#2 C3#2 C4#2 C5#2 C6#2 C7#2 C10 C11#2 C13#2 C14#2 C15#2 C17#2 C19#2 C20#2 C22#2 C23#2 C24#2 C26#2 = C0402: Capacitor, 0402, X5R, ±20%; Part Number: C0402-4µ7; Manufacturer: N.A.; Part number IPS: 00000001251, 00000007165; Note: 10V; Artikkelnr Noca: 20039482; Pad Count: 2; Manufacturer Part Number: N.A.; LatestRevisionDate: 2017-11-09; Published: 2009-05-08; Footprint Doc: 0402; ComponentLink1Description: Datasheet; ComponentLink1URL: N.A.; ComponentLink2Description: Supplier link; ComponentLink2URL: N.A.; HelpURL: N.A.; Supplier 1: Digi-Key; Supplier Part Number 1: 490-13252-1-ND; Supplier 2: N.A.; Supplier Part Number 2: N.A.; PartId: 100200193; Component Class: Capacitors; Author: rsk; Part number Norautron: N.A.
  C1#2 C2#2 C3#2 C4#2 C6#2 C7#2: Value: 3.3 uF
  C5#2: Value: 10 nF
  C10 C14#2 C17#2 C20#2 C22#2 C24#2: Value: 1.0 uF
  C11#2 C15#2 C19#2 C23#2: Value: 100 nF
  C13#2: Value: 10 uF
  C26#2: Value: 4.7 uF
C8#2 C28#2 = C0402: Capacitor, 0402, X7R, ±20%; Part Number: C0402-4µ7; Manufacturer: N.A.; Part number IPS: 00000001251, 00000007165; Note: 10V; Artikkelnr Noca: 20039482; Pad Count: 2; Manufacturer Part Number: N.A.; LatestRevisionDate: 2017-11-09; Published: 2009-05-08; Footprint Doc: 0402; ComponentLink1Description: Datasheet; ComponentLink1URL: N.A.; ComponentLink2Description: Supplier link; ComponentLink2URL: N.A.; HelpURL: N.A.; Supplier 1: Digi-Key; Supplier Part Number 1: 490-13252-1-ND; Supplier 2: N.A.; Supplier Part Number 2: N.A.; PartId: 100200193; Component Class: Capacitors; Author: rsk; Part number Norautron: N.A.
  C8#2: Value: 0.1 uF
  C28#2: Value: 4.7 uF
C9#2 C16#2 C18#2 C21#2 C25#2 C27#2 = C0402: Capacitor, 0402, X7R, ±10%; Part Number: C0402-4µ7; Manufacturer: N.A.; Part number IPS: 00000001251, 00000007165; Note: 10V; Artikkelnr Noca: 20039482; Pad Count: 2; Manufacturer Part Number: N.A.; LatestRevisionDate: 2017-11-09; Published: 2009-05-08; Footprint Doc: 0402; ComponentLink1Description: Datasheet; ComponentLink1URL: N.A.; ComponentLink2Description: Supplier link; ComponentLink2URL: N.A.; HelpURL: N.A.; Supplier 1: Digi-Key; Supplier Part Number 1: 490-13252-1-ND; Supplier 2: N.A.; Supplier Part Number 2: N.A.; PartId: 100200193; Component Class: Capacitors; Author: rsk; Part number Norautron: N.A.
  C9#2 C18#2 C25#2 C27#2: Value: 1 uF
  C16#2 C21#2: Value: 10 uF
C12#2 = C0805: Capacitor, 0805; Part Number: C0603-4µ7; Manufacturer: N.A.; Part number IPS: 00000007783; Note: 6.3V; Artikkelnr Noca: 20069060; Pad Count: 2; Manufacturer Part Number: N.A.; LatestRevisionDate: 2009-11-23; Published: 2009-05-08; Value: 100 uF; Footprint Doc: 0603; ComponentLink1Description: Datasheet; ComponentLink1URL: N.A.; ComponentLink2Description: Supplier link; ComponentLink2URL: N.A.; HelpURL: N.A.; Supplier 1: N.A.; Supplier Part Number 1: N.A.; Supplier 2: N.A.; Supplier Part Number 2: N.A.; PartId: 100200274; Component Class: Capacitors; Author: rsk; Part number Norautron: N.A.
J1#2 J2#2 = 54102-0404: 0.50mm Pitch SlimStack Receptacle, Surface Mount, Dual Row, Vertical, 2.50mm Stacking Height, Gold Plating with Nickel Barrier, 40 Circuits; Manufacturer_Name: Molex; System: Connector; Datasheet Link: https://www.molex.com/pdm_docs/sd/541020404_sd.pdf; Height: 2.2mm; Manufacturer_Part_Number: 54102-0404; Mouser Part Number: 538-54102-0404; Mouser Price/Stock: https://www.mouser.co.uk/ProductDetail/Molex/54102-0404?qs=QVBMgXxBiLzLp7HESxZcuA%3D%3D
J3 J4 = 530470810: Connector; Manufacturer_Name: Molex; Datasheet Link: https://www.molex.com/pdm_docs/sd/530470210_sd.pdf; Height: 4.2mm; Manufacturer_Part_Number: 530470810
J5 = S2B-PH-KL_LF__SN_: Connector; Manufacturer_Name: JST (JAPAN SOLDERLESS TERMINALS); Manufacturer_Part_Number: S2B-PH-KL(LF)(SN); Datasheet Link: https://www.jst-mfg.com/product/pdf/eng/ePH.pdf; Height: 4.8mm
J6 = CON_012pin_2x6: Con 12 pins 2x6
J7 = SK-3296S-01-L1: Connector; Manufacturer_Name: XKB Connectivity; Datasheet Link: https://datasheet.lcsc.com/szlcsc/XKB-SK-3296S-01-L1_C319020.pdf; Height: 1.4mm; Manufacturer_Part_Number: SK-3296S-01-L1
Q1 Q2 = BSS138BKVL: MOSFET (N-Channel); Manufacturer_Name: Nexperia; Datasheet Link: https://assets.nexperia.com/documents/data-sheet/BSS138BK.pdf; Height: 1.1mm; Manufacturer_Part_Number: BSS138BKVL; Mouser Part Number: 771-BSS138BKVL; Mouser Price/Stock: https://www.mouser.co.uk/ProductDetail/Nexperia/BSS138BKVL?qs=45Avz0nZxhsC3lw2Q7S%2FBA%3D%3D; Arrow Part Number: BSS138BKVL; Arrow Price/Stock: https://www.arrow.com/en/products/bss138bkvl/nexperia?region=europe
R1#2 R2#2 R3#2 R4#2 R5#2 R6#2 R7#2 R8-R16 R19-R27 = R0402: Resistor, 0402, ±1%, 0.05W; Part Number: R0201-10k; Manufacturer: N.A.; Part number IPS: 00000001255; Note: Chip Res 1%; Pad Count: 2; Manufacturer Part Number: N.A.; LatestRevisionDate: 2014-11-13; Published: 2014-11-13; Artikkelnr Noca: N.A.; Footprint Doc: 0201; ComponentLink1Description: Datasheet; ComponentLink1URL: N.A.; ComponentLink2Description: Supplier link; ComponentLink2URL: N.A.; HelpURL: N.A.; Supplier 1: N.A.; Supplier Part Number 1: N.A.; Supplier 2: N.A.; Supplier Part Number 2: N.A.; PartId: 100100065; Component Class: Resistors; Author: rsk; Part number Norautron: N.A.
  R1#2: Value: 390K
  R2#2 R3#2 R4#2 R5#2 R6#2 R7#2 R8 R9: Value: 200
  R10: Value: 5.1K
  R11-R14 R19 R20 R22 R26: Value: 100K
  R15 R16: Value: 10K
  R21 R25: Value: 46K
  R23 R24: Value: 1
  R27: Value: 10
R17 R18 = R0603: Resistor, 0603; Part Number: R0201-10k; Manufacturer: N.A.; Part number IPS: 00000001255; Note: Chip Res 1%; Pad Count: 2; Manufacturer Part Number: N.A.; LatestRevisionDate: 2014-11-13; Published: 2014-11-13; Value: 0; Artikkelnr Noca: N.A.; Footprint Doc: 0201; ComponentLink1Description: Datasheet; ComponentLink1URL: N.A.; ComponentLink2Description: Supplier link; ComponentLink2URL: N.A.; HelpURL: N.A.; Supplier 1: N.A.; Supplier Part Number 1: N.A.; Supplier 2: N.A.; Supplier Part Number 2: N.A.; PartId: 100100065; Component Class: Resistors; Author: rsk; Part number Norautron: N.A.
S1 = DHN-02F-V-T_R: Switch; Manufacturer_Name: Diptronics; Manufacturer_Part_Number: DHN-02F-V-T/R; Datasheet Link: https://www.mouser.com/datasheet/2/910/377_DHNF-1571321.pdf; Height: 1.65mm; Mouser Part Number: 113-DHN02FVTR; Mouser Price/Stock: https://www.mouser.co.uk/ProductDetail/Diptronics/DHN-02F-V-T-R?qs=MLItCLRbWsyqCqWUbs6C5Q%3D%3D
S2 = DHN-08F-T-V-T_R: Switch; Manufacturer_Name: Diptronics; Manufacturer_Part_Number: DHN-08F-T-V-T/R; Datasheet Link: https://www.mouser.com/datasheet/2/910/377_DHNF-1571321.pdf; Height: 1.53mm; Mouser Part Number: 113-DHN08FTVTR; Mouser Price/Stock: https://www.mouser.co.uk/ProductDetail/Diptronics/DHN-08F-T-V-T-R?qs=MLItCLRbWsx18ED%2FADfjTQ%3D%3D
SB1#2 = Solderbridge Shorted: as SB2 on sheet caton-nrf52840; Part Number: Solderbridge Shorted; Manufacturer Part Number: N.A.; Footprint Doc: Solderbridge_Shorted; LatestRevisionDate: 2012-08-07; Published: 2012-08-07; Value: Shorted; Note: N.A.; Artikkelnr Noca: N.A.; Part number IPS: N.A.; ComponentLink1Description: Datasheet; ComponentLink1URL: N.A.; ComponentLink2Description: Supplier link; ComponentLink2URL: N.A.; HelpURL: N.A.; Supplier 1: N.A.; Supplier Part Number 1: N.A.; Supplier 2: N.A.; Supplier Part Number 2: N.A.; PartId: 100500459; Component Class: Connectors; Author: rsk; Part number Norautron: N.A.
U1#2 = CMP-0841-00002-2: Low-Noise, 8-Channel, 24-Bit Analog Front-End for Biopotential Measurement, 16 KSPS, -40 to 85 degC, 64-Pin PQFP (PAG-64), RoHS, Tube; Manufacturer: Texas Instruments; Architecture: Delta-Sigma; Reference Mode: Int, Ext; # Input Channels: 8; Resolution (Bits): 24; Sample Rate (max) (KSPS): 16; Interface: Serial SPI; Packing: PAG0064A; PackageVersion: 4040282/C; PackageReference: PAG-64; ComponentLink3Description: Package Specification; DatasheetVersion: SBAS499A; ComponentLink1Description: Manufacturer URL; ComponentLink2Description: Datasheet; PackageDescription: 64-Pin Plastic Quad Flatpack, Body 10 x 10 mm, Pitch 0.5 mm; RoHS: TRUE; Operating Temperature Range (C): -40 to 85; ComponentLink3URL: http://www.ti.com/lit/ml/mtqf006a/mtqf006a.pdf; ComponentLink1URL: http://www.ti.com/; ComponentLink2URL: http://www.ti.com/lit/ds/symlink/ads1299.pdf; PartNumber: ADS1299IPAG; Mounting Technology: Surface Mount
U2 = TLV71311PDBVR: Integrated Circuit; Manufacturer_Name: Texas Instruments; Datasheet Link: http://www.ti.com/lit/gpn/tlv713p; Height: 1.45mm; Manufacturer_Part_Number: TLV71311PDBVR; Mouser Part Number: 595-TLV71311PDBVR; Mouser Price/Stock: https://www.mouser.com/Search/Refine.aspx?Keyword=595-TLV71311PDBVR; Arrow Part Number: TLV71311PDBVR; Arrow Price/Stock: https://www.arrow.com/en/products/tlv71311pdbvr/texas-instruments
U3 = LM2775DSGR: Integrated Circuit; Manufacturer_Name: Texas Instruments; Datasheet Link: http://www.ti.com/lit/ds/symlink/lm2775.pdf; Height: 0.8mm; Manufacturer_Part_Number: LM2775DSGR; Mouser Part Number: 595-LM2775DSGR; Mouser Price/Stock: https://www.mouser.co.uk/ProductDetail/Texas-Instruments/LM2775DSGR?qs=GURawfaeGuBqI9Vb8ZKJyg%3D%3D; Arrow Part Number: LM2775DSGR; Arrow Price/Stock: https://www.arrow.com/en/products/lm2775dsgr/texas-instruments
U4 U5 = CMP-0062-01430-3: Series of Adjustable Micropower Voltage Regulators, 8-pin LLP, Pb-Free; Manufacturer: Texas Instruments; PackageTopMarking: NS*UZXYTT*2951AC; CompType: LDO IC; PowerWise: N; ComponentLink1URL: http://www.ti.com/general/docs/lit/getliterature.tsp?genericPartNumber=LP2951-N&fileType=pdf; PackageDescription: LLP, Plastic, Dual, 4 x 4 x 0.8mm Body, 8 Lead, 0.8mm Pitch, No Pullback; ComponentLink1Description: Datasheet URL; PackageReference: NGT0008A; PinCount: 8; RoHS: Y
Z1-Z4 = MM5Z5V1T1G: Zener Diode; Manufacturer_Name: onsemi; Datasheet Link: http://www.onsemi.com/pub/Collateral/MM5Z2V4T1-D.PDF; Height: 0.7mm; Manufacturer_Part_Number: MM5Z5V1T1G; Mouser Part Number: 863-MM5Z5V1T1G; Mouser Price/Stock: https://www.mouser.co.uk/ProductDetail/onsemi/MM5Z5V1T1G?qs=HVbQlW5zcXWngQFSpylEhA%3D%3D; Arrow Part Number: MM5Z5V1T1G; Arrow Price/Stock: https://www.arrow.com/en/products/mm5z5v1t1g/on-semiconductor?region=nac